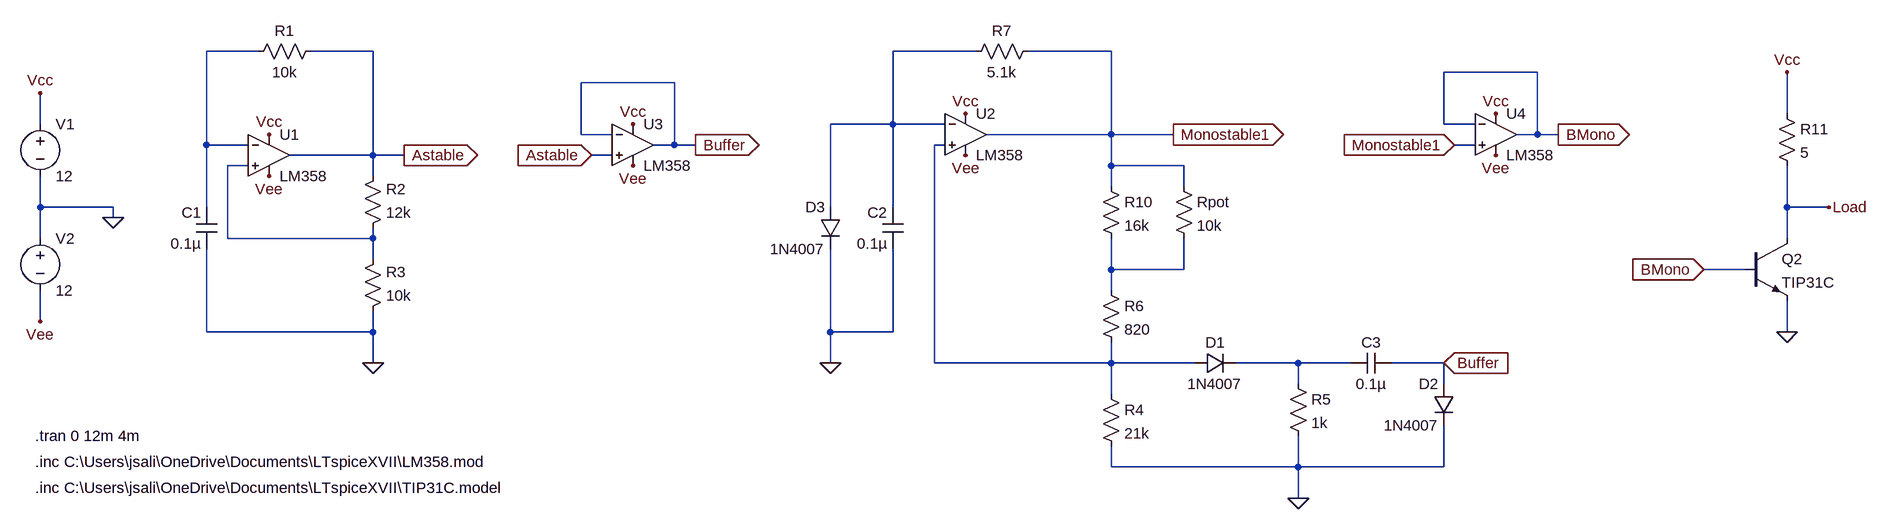
[diagram p0: schematic multivibrators.asc]
multivibrators.asc, the LTspice schematic file:
Version 4
SHEET 1 2532 932
WIRE -320 -176 -400 -176
WIRE -144 -176 -240 -176
WIRE 784 -176 656 -176
WIRE 992 -176 864 -176
WIRE 1648 -144 1504 -144
WIRE 320 -128 176 -128
WIRE 2032 -80 2032 -144
WIRE -656 -64 -656 -112
WIRE 656 -64 656 -176
WIRE 656 -64 560 -64
WIRE 736 -64 656 -64
WIRE 1504 -64 1504 -144
WIRE 1552 -64 1504 -64
WIRE 176 -48 176 -128
WIRE 224 -48 176 -48
WIRE 992 -48 992 -176
WIRE 992 -48 800 -48
WIRE 1088 -48 992 -48
WIRE 1648 -48 1648 -144
WIRE 1648 -48 1616 -48
WIRE 1680 -48 1648 -48
WIRE -400 -32 -400 -176
WIRE -336 -32 -400 -32
WIRE 320 -32 320 -128
WIRE 320 -32 288 -32
WIRE 352 -32 320 -32
WIRE 736 -32 720 -32
WIRE 1552 -32 1520 -32
WIRE -144 -16 -144 -176
WIRE -144 -16 -272 -16
WIRE -96 -16 -144 -16
WIRE 224 -16 192 -16
WIRE -336 0 -368 0
WIRE 992 0 992 -48
WIRE 1104 0 992 0
WIRE -144 16 -144 -16
WIRE 992 32 992 0
WIRE 1104 32 1104 0
WIRE -656 64 -656 16
WIRE -544 64 -656 64
WIRE -400 64 -400 -32
WIRE 560 64 560 -64
WIRE 656 64 656 -64
WIRE 2032 64 2032 0
WIRE 2096 64 2032 64
WIRE -544 80 -544 64
WIRE -656 112 -656 64
WIRE -368 112 -368 0
WIRE -144 112 -144 96
WIRE -144 112 -368 112
WIRE 2032 112 2032 64
WIRE -144 144 -144 112
WIRE 992 160 992 112
WIRE 1104 160 1104 112
WIRE 1104 160 992 160
WIRE 1968 160 1904 160
WIRE 992 192 992 160
WIRE -656 240 -656 192
WIRE -400 256 -400 128
WIRE -144 256 -144 224
WIRE -144 256 -400 256
WIRE 560 256 560 128
WIRE 656 256 656 128
WIRE 656 256 560 256
WIRE 2032 256 2032 208
WIRE -144 304 -144 256
WIRE 560 304 560 256
WIRE 720 304 720 -32
WIRE 992 304 992 272
WIRE 992 304 720 304
WIRE 1120 304 992 304
WIRE 1280 304 1184 304
WIRE 1360 304 1280 304
WIRE 1504 304 1424 304
WIRE 1280 336 1280 304
WIRE 1504 336 1504 304
WIRE 992 352 992 304
WIRE 992 464 992 432
WIRE 1280 464 1280 416
WIRE 1280 464 992 464
WIRE 1504 464 1504 400
WIRE 1504 464 1280 464
WIRE 1280 512 1280 464
FLAG -544 80 0
FLAG -656 -112 Vcc
FLAG -656 240 Vee
FLAG -304 -48 Vcc
FLAG 768 -80 Vcc
FLAG 768 -16 Vee
FLAG 256 -64 Vcc
FLAG 256 0 Vee
FLAG 192 -16 Astable
IOPIN 192 -16 In
FLAG 352 -32 Buffer
IOPIN 352 -32 Out
FLAG -144 304 0
FLAG 560 304 0
FLAG 1088 -48 Monostable1
IOPIN 1088 -48 Out
FLAG -96 -16 Astable
IOPIN -96 -16 Out
FLAG 1280 512 0
FLAG 1504 304 Buffer
IOPIN 1504 304 In
FLAG 2032 -144 Vcc
FLAG 1904 160 BMono
IOPIN 1904 160 In
FLAG -304 16 Vee
FLAG 2032 256 0
FLAG 2096 64 Load
FLAG 1584 -80 Vcc
FLAG 1584 -16 Vee
FLAG 1520 -32 Monostable1
IOPIN 1520 -32 In
FLAG 1680 -48 BMono
IOPIN 1680 -48 Out
SYMBOL res -160 112 M180
WINDOW 0 36 76 Left 2
WINDOW 3 36 40 Left 2
SYMATTR InstName R2
SYMATTR Value 12k
SYMBOL res -160 240 M180
WINDOW 0 36 76 Left 2
WINDOW 3 36 40 Left 2
SYMATTR InstName R3
SYMATTR Value 10k
SYMBOL cap -384 64 M0
SYMATTR InstName C1
SYMATTR Value 0.1µ
SYMBOL voltage -656 -80 R0
SYMATTR InstName V1
SYMATTR Value 12
SYMBOL voltage -656 96 R0
SYMATTR InstName V2
SYMATTR Value 12
SYMBOL diode 576 64 M0
SYMATTR InstName D3
SYMATTR Value 1N4007
SYMBOL cap 672 64 M0
SYMATTR InstName C2
SYMATTR Value 0.1µ
SYMBOL OpAmps\\opamp2 -304 -80 R0
SYMATTR InstName U1
SYMATTR Value LM358
SYMBOL OpAmps\\opamp2 768 -112 R0
SYMATTR InstName U2
SYMATTR Value LM358
SYMBOL OpAmps\\opamp2 256 -96 R0
SYMATTR InstName U3
SYMATTR Value LM358
SYMBOL res -224 -192 R90
WINDOW 0 0 56 VBottom 2
WINDOW 3 32 56 VTop 2
SYMATTR InstName R1
SYMATTR Value 10k
SYMBOL res 880 -192 R90
WINDOW 0 0 56 VBottom 2
WINDOW 3 32 56 VTop 2
SYMATTR InstName R7
SYMATTR Value 5.1k
SYMBOL res 976 336 R0
SYMATTR InstName R4
SYMATTR Value 21k
SYMBOL diode 1120 288 M90
WINDOW 0 0 32 VBottom 2
WINDOW 3 32 32 VTop 2
SYMATTR InstName D1
SYMATTR Value 1N4007
SYMBOL diode 1520 336 M0
SYMATTR InstName D2
SYMATTR Value 1N4007
SYMBOL res 1264 320 R0
SYMATTR InstName R5
SYMATTR Value 1k
SYMBOL cap 1424 288 R90
WINDOW 0 0 32 VBottom 2
WINDOW 3 32 32 VTop 2
SYMATTR InstName C3
SYMATTR Value 0.1µ
SYMBOL res 976 176 R0
SYMATTR InstName R6
SYMATTR Value 820
SYMBOL res 976 16 R0
SYMATTR InstName R10
SYMATTR Value 16k
SYMBOL res 1088 16 R0
SYMATTR InstName Rpot
SYMATTR Value 10k
SYMBOL npn 1968 112 R0
SYMATTR InstName Q2
SYMATTR Value TIP31C
SYMBOL res 2016 -96 R0
SYMATTR InstName R11
SYMATTR Value 5
SYMBOL OpAmps\\opamp2 1584 -112 R0
SYMATTR InstName U4
SYMATTR Value LM358
TEXT -664 416 Left 2 !.tran 0 12m 4m
TEXT -664 456 Left 2 !.inc C:\\Users\\jsali\\OneDrive\\Documents\\LTspiceXVII\\LM358.mod
TEXT -664 496 Left 2 !.inc C:\\Users\\jsali\\OneDrive\\Documents\\LTspiceXVII\\TIP31C.model

The netlist it stands for:
* multivibrators.asc
R2 N004 Astable 12k
R3 0 N004 10k
C1 N001 0 0.1µ
V1 Vcc 0 12
V2 0 Vee 12
D3 N002 0 1N4007
C2 N002 0 0.1µ
XU1 N004 N001 Vcc Vee Astable LM358  ; pins In+ In- V+ V- OUT
XU2 N003 N002 Vcc Vee Monostable1 LM358  ; pins In+ In- V+ V- OUT
XU3 Astable Buffer Vcc Vee Buffer LM358  ; pins In+ In- V+ V- OUT
R1 Astable N001 10k
R7 Monostable1 N002 5.1k
R4 N003 0 21k
D1 N003 N006 1N4007
D2 Buffer 0 1N4007
R5 N006 0 1k
C3 Buffer N006 0.1µ
R6 N005 N003 820
R10 Monostable1 N005 16k
Rpot Monostable1 N005 10k
Q2 Load BMono 0 0 TIP31C
R11 Vcc Load 5
XU4 Monostable1 BMono Vcc Vee BMono LM358  ; pins In+ In- V+ V- OUT
.model D D
.lib standard.dio
.model NPN NPN
.model PNP PNP
.lib standard.bjt
.tran 0 12m 4m
.inc C:\Users\jsali\OneDrive\Documents\LTspiceXVII\LM358.mod
.inc C:\Users\jsali\OneDrive\Documents\LTspiceXVII\TIP31C.model
.backanno
.end